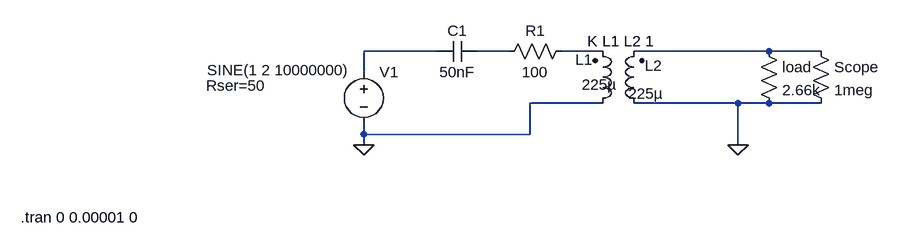
[diagram p0: schematic simple_transformer.asc]
simple_transformer.asc, the LTspice schematic file:
Version 4
SHEET 1 920 680
WIRE 224 80 112 80
WIRE 336 80 288 80
WIRE 480 80 416 80
WIRE 736 80 528 80
WIRE 816 80 736 80
WIRE 112 112 112 80
WIRE 480 160 368 160
WIRE 688 160 528 160
WIRE 736 160 688 160
WIRE 816 160 736 160
WIRE 112 208 112 192
WIRE 368 208 368 160
WIRE 368 208 112 208
WIRE 112 224 112 208
WIRE 688 224 688 160
FLAG 112 224 0
FLAG 688 224 0
SYMBOL voltage 112 96 R0
WINDOW 3 -241 13 Left 2
WINDOW 123 0 0 Left 2
WINDOW 39 -243 37 Left 2
SYMATTR Value SINE(1 2 10000000)
SYMATTR SpiceLine Rser=50
SYMATTR InstName V1
SYMBOL cap 288 64 R90
WINDOW 0 0 32 VBottom 2
WINDOW 3 32 32 VTop 2
SYMATTR InstName C1
SYMATTR Value 50nF
SYMBOL res 432 64 R90
WINDOW 0 0 56 VBottom 2
WINDOW 3 32 56 VTop 2
SYMATTR InstName R1
SYMATTR Value 100
SYMBOL ind2 544 176 R180
WINDOW 0 -28 74 Left 2
WINDOW 3 -29 31 Left 2
SYMATTR InstName L2
SYMATTR Value 225µ
SYMATTR Type ind
SYMBOL res 800 64 R0
SYMATTR InstName Scope
SYMATTR Value 1meg
SYMBOL ind2 464 176 M180
WINDOW 0 -26 83 Left 2
WINDOW 3 -16 45 Left 2
SYMATTR InstName L1
SYMATTR Value 225µ
SYMATTR Type ind
SYMBOL res 720 64 R0
SYMATTR InstName load
SYMATTR Value 2.66k
TEXT -416 336 Left 2 !.tran 0 0.00001 0
TEXT 456 64 Left 2 !K L1 L2 1

The netlist it stands for:
* simple_transformer.asc
V1 N001 0 SINE(1 2 10000000) Rser=50
C1 N002 N001 50nF
R1 N003 N002 100
L2 0 N004 225µ
R§Scope N004 0 1meg
L1 0 N003 225µ
R§load N004 0 2.66k
.tran 0 0.00001 0
K L1 L2 1
.backanno
.end